# Altium project PCB_Project1.PrjPCB
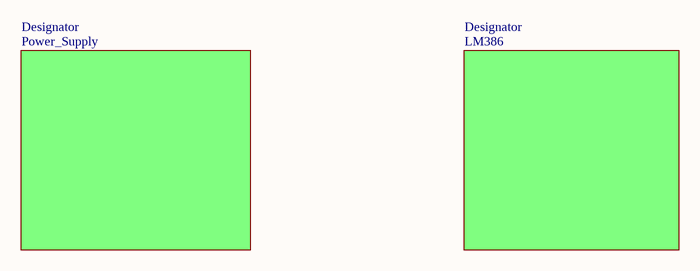
[diagram p0: Sheet1.SchDoc]
3 sheets, 39 parts. Net scope: global (net labels, ports and power ports of the same name join across sheets).
Board file: PCB1.PcbDoc
Sheets:
  Sheet1.SchDoc
    Designator = Power_Supply.SchDoc
    Designator = LM386.SchDoc

## Sheet Sheet1.SchDoc
size A4

### Sub-sheets
Designator = Power_Supply: no entries
Designator = LM386: no entries

## Sheet Power_Supply.SchDoc
size A4
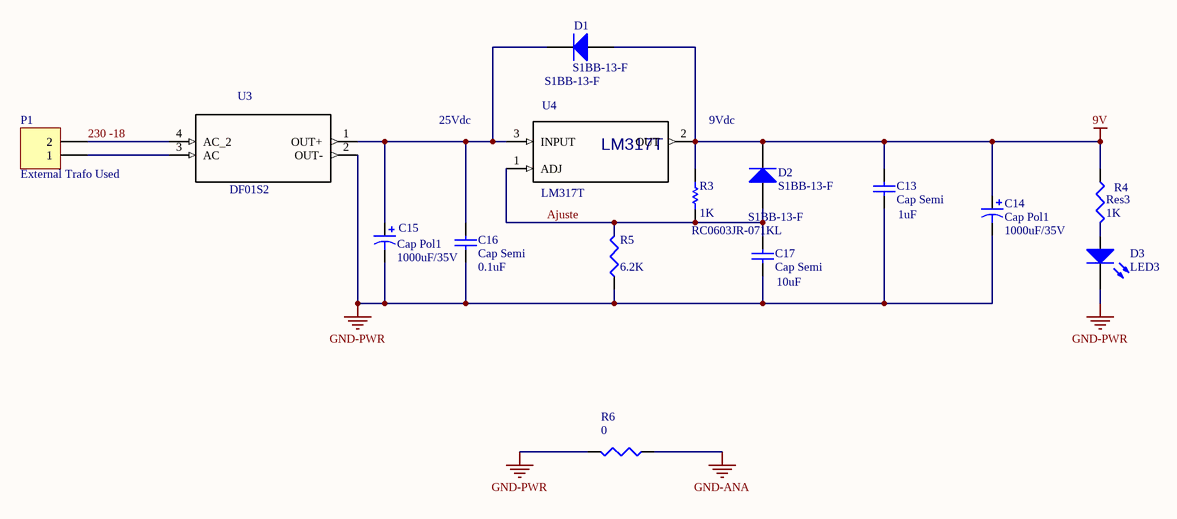
[diagram p1: Power_Supply.SchDoc]

### Parts
C13  Cap Semi  value 1uF  [1608[0603]]
C14  Cap Pol1  value 1000uF/35V  [RB7.6-15]
C15  Cap Pol1  value 1000uF/35V  [RB7.6-15]
C16  Cap Semi  value 0.1uF  [1608[0603]]
C17  Cap Semi  value 10uF  [1608[0603]]
D1  S1BB-13-F  [DIOM505270X240]
D2  S1BB-13-F  [DIOM505270X240]
D3  LED3  [6-0805_L]
P1  External Trafo Used  [PCBComponent_1]
R3  value 1K  PN: RC0603JR-071KL  [J1-0603]  (hidden comment: Res1)
R4  Res3  value 1K  [J1-0603]
R5  value 6.2K  [J1-0603]  (hidden comment: Res3)
R6  value 0  [6-0805_N]  (hidden comment: Res3)
U3  DF01S2  [SOT508P985X260-4N]
U4  LM317T  [TO254P460X1020X1945-3P]

### Nets
9V: C13.2 C14.1 D1.1(A) D2.2(K) R3.1 R4.1 U4.2(OUT)
GND-ANA: R6.1
GND-PWR: C13.1 C14.2 C15.2 C16.1 C17.1 D3.2(K) R5.1 R6.2 U3.2(OUT-)
230 -18: P1.2 U3.4(AC_2)
Ajuste: C17.2 D2.1(A) R3.2 R5.2 U4.1(ADJ)
NetC15_1: C15.1 C16.2 D1.2(K) U3.1(OUT+) U4.3(INPUT)
NetD3_1: D3.1(A) R4.2
NetP1_1: P1.1 U3.3(AC)

### Notes on the sheet
- 25Vdc
- 9Vdc

### Library data of the parts
C13 = Cap Semi: Capacitor (Semiconductor SIM Model) C1608JB1V105K080AB; PN: CL10A105KL8NNNC; Published: 8-Jun-2000; LatestRevisionDate: 29-May-2009; LatestRevisionNote: IPC-7351 Footprint Added.; PackageReference: C1206; Publisher: Altium Limited; PackageDescription: Chip Capacitor
C14 C15 = Cap Pol1: Polarized Capacitor (Radial) URS1V102MHD; Published: 8-Jun-2000; LatestRevisionDate: 17-Jul-2002; LatestRevisionNote: Re-released for DXP Platform.; PackageReference: RB7.6-15; Publisher: Altium Limited; PackageDescription: Polarized Capacitor (Radial); 2 Leads; PN: URS1V102MHD
C16 = Cap Semi: Capacitor (Semiconductor SIM Model) C0603T104J5RACTU; PN: CC0603JRX7R9BB104; Published: 8-Jun-2000; LatestRevisionDate: 29-May-2009; LatestRevisionNote: IPC-7351 Footprint Added.; PackageReference: C1206; Publisher: Altium Limited; PackageDescription: Chip Capacitor
C17 = Cap Semi: Capacitor (Semiconductor SIM Model) GRM188R6YA106MA73D; PN: C2012JB1V106K125AC; Published: 8-Jun-2000; LatestRevisionDate: 29-May-2009; LatestRevisionNote: IPC-7351 Footprint Added.; PackageReference: C1206; Publisher: Altium Limited; PackageDescription: Chip Capacitor
D1 D2 = Diode 1N4002: 100V 1 Amp General Purpose Rectifier; pin to pad: 1>A 2>C; Published: 8-Jun-2000; LatestRevisionDate: 17-Jul-2002; LatestRevisionNote: Re-released for DXP Platform.; DatasheetVersion: 1998; PackageVersion: Aug-1999; PackageReference: DO-41; Publisher: Altium Limited; PackageDescription: Diode, Axial; Body 5.2 x 2.7 mm (LxDia. max), Lead Dia. 0.86 mm (max); Code_JEDEC: DO-204-AL; ComponentLink1Description: Manufacturer Link; ComponentLink1URL: http://www.fairchildsemi.com/; ComponentLink2Description: Datasheet; ComponentLink2URL: http://www.fairchildsemi.com/ds/1N%2F1N4001.pdf; Supplier 1: Mouser; Supplier Part Number 1: 621-S1BB-F; PN: S1BB-13-F
D3 = LED3: Typical BLUE SiC LED IN-S85ATR; PN: SML-H12P8TT86C; Published: 8-Jun-2000; LatestRevisionDate: 17-Dec-2003; LatestRevisionNote: PCB Footprint replaced.; DatasheetVersion: 16-Apr-2002; PackageVersion: 16-Apr-2002; PackageReference: 3.5X2.8X1.9; Publisher: Altium Limited; PackageDescription: SM LED; 2 C-Bend Leads; Body 3.5 x 2.8 x 1.9 mm, inc leads (LxWxH typ)
P1 = MHDR1X2: Header, 2-Pin; LatestRevisionDate: 17-Jul-2002; LatestRevisionNote: Re-released for DXP Platform.; Publisher: Altium Limited
R3 = Res1: Resistor ERJ-PA3J102V; Published: 8-Jun-2000; LatestRevisionDate: 17-Jul-2002; LatestRevisionNote: Re-released for DXP Platform.; PackageReference: AXIAL-0.3; Publisher: Altium Limited; PackageDescription: Axial Device, Thru-Hole; 2 Leads; 0.3 in Pin Spacing
R4 = Res3: Resistor ERJ-PA3J102V; PN: RC0603JR-071KL; Published: 8-Jun-2000; LatestRevisionDate: 29-May-2009; LatestRevisionNote: IPC-7351 Footprint Added.; PackageReference: J1-0603; Publisher: Altium Limited; PackageDescription: Chip Resistor
R5 = Res3: Resistor ERJ-PA3J622V; Published: 8-Jun-2000; LatestRevisionDate: 29-May-2009; LatestRevisionNote: IPC-7351 Footprint Added.; PackageReference: J1-0603; Publisher: Altium Limited; PackageDescription: Chip Resistor; PN: ERJ-PA3J622V
R6 = Res3: Resistor; PN: CRCW08050000Z0EAC; Published: 8-Jun-2000; LatestRevisionDate: 29-May-2009; LatestRevisionNote: IPC-7351 Footprint Added.; PackageReference: J1-0603; Publisher: Altium Limited; PackageDescription: Chip Resistor
U3 = DF01S: DF01S Series 1.5 A 100 V 5 uA Surface Mount Bridge Rectifier -SDIP-4; MF: ON Semiconductor; SnapEDA_Link: https://www.snapeda.com/parts/DF01S/ON%20Semiconductor/view-part/?ref=snap; MP: DF01S2; Package: SMD-4 ON Semiconductor; Digi-Key_Purchase_URL: https://www.digikey.es/product-detail/en/diodes-incorporated/DF01S/DF01SDI-ND/149499?utm_source=snapeda&utm_medium=aggregator&utm_campaign=symbol; Digi-Key_Part_Number: DF01SDI-ND; Value: *
U4 = LM317T: MF: Texas Instruments; SnapEDA_Link: https://www.snapeda.com/parts/LM317T/Texas%20Instruments/view-part/?ref=snap; PN: LM317T; Package: TO-220-3 HTC Korea; Price: None; Availability: Unavailable; Value: *

## Sheet LM386.SchDoc
size A4
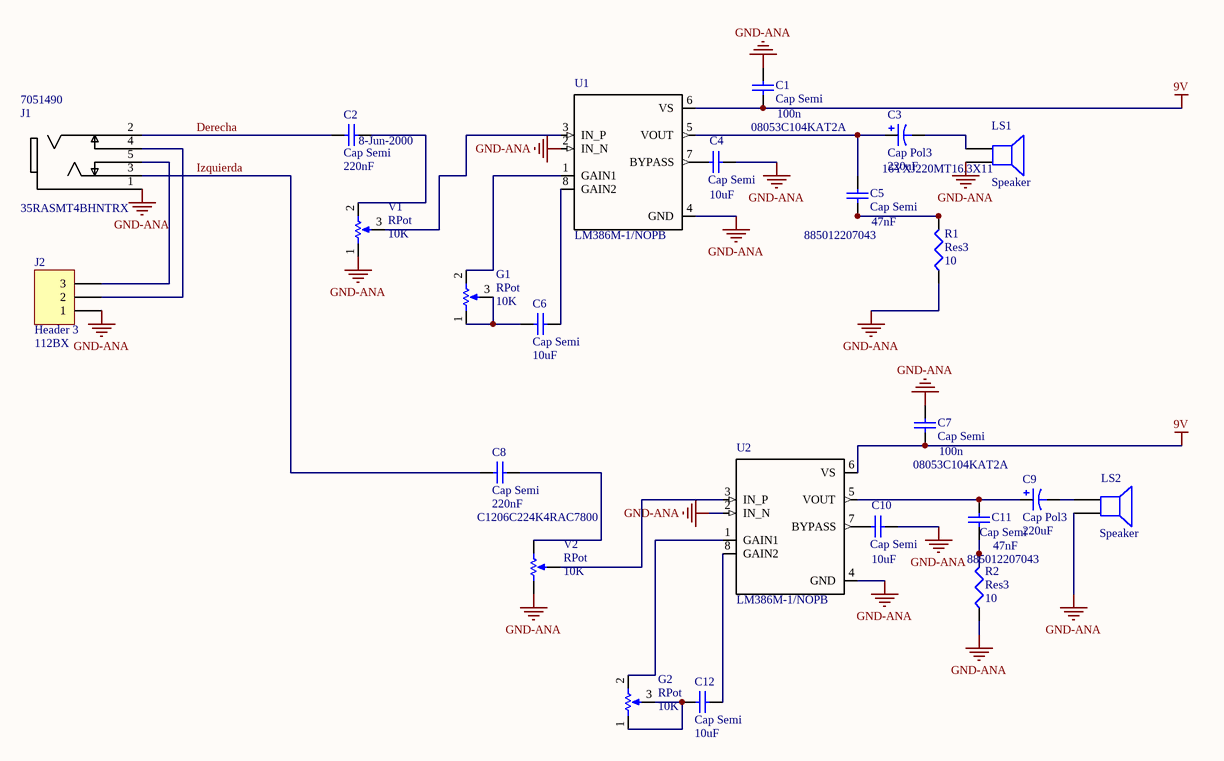
[diagram p2: LM386.SchDoc]

### Parts
C1  Cap Semi  value 100n  PN: 08053C104KAT2A  [C0805]
C2  Cap Semi  value 220nF  Published: 8-Jun-2000  [C1206]
C3  Cap Pol3  value 220uF  PN: 16YXJ220MT16.3X11  [C0805]
C4  Cap Semi  value 10uF  [C1206]
C5  Cap Semi  value 47nF  PN: 885012207043  [C0805]
C6  Cap Semi  value 10uF  [C0805]
C7  Cap Semi  value 100n  PN: 08053C104KAT2A  [C0805]
C8  Cap Semi  value 220nF  PN: C1206C224K4RAC7800  [C1206]
C9  Cap Pol3  value 220uF  [C0805]
C10  Cap Semi  value 10uF  [C0805]
C11  Cap Semi  value 47nF  PN: 885012207043  [C0805]
C12  Cap Semi  value 10uF  [C0805]
G1  RPot  value 10K  [Potenciometer]
G2  RPot  value 10K  [Potenciometer]
J1  35RASMT4BHNTRX  Supplier Part Number 1: 7051490  [SWITCHCRAFT_35RASMT4BHNTRX]
J2  Header 3  PN: 112BX  [HDR1X3]
LS1  Speaker  [PIN2]
LS2  Speaker  [PIN2]
R1  Res3  value 10  [SMD-0805-RES]
R2  Res3  value 10  [SMD-0805-RES]
U1  LM386M-1/NOPB  [SOIC127P600X175-8N]
U2  LM386M-1/NOPB  [SOIC127P600X175-8N]
V1  RPot  value 10K  [Potenciometer]
V2  RPot  value 10K  [Potenciometer]

### Nets
9V: C1.2 C7.2 U1.6(VS) U2.6(VS)
GND-ANA: C1.1 C4.1 C7.1 C10.1 J1.1 J2.1 LS1.2 LS2.2 R1.1 R2.1 U1.2(IN_N) U1.4(GND) U2.2(IN_N) U2.4(GND) V1.1(TOP) V2.1(TOP)
Derecha: C2.2 J1.2
Izquierda: C8.2 J1.3
NetC2_1: C2.1 V1.2(BOT)
NetC3_1: C3.1 C5.1 U1.5(VOUT)
NetC3_2: C3.2 LS1.1
NetC4_2: C4.2 U1.7(BYPASS)
NetC5_2: C5.2 R1.2
NetC6_1: C6.1 U1.8(GAIN2)
NetC6_2: C6.2 G1.1(TOP) G1.3(TAP)
NetC8_1: C8.1 V2.2(BOT)
NetC9_1: C9.1 C11.1 U2.5(VOUT)
NetC9_2: C9.2 LS2.1
NetC10_2: C10.2 U2.7(BYPASS)
NetC11_2: C11.2 R2.2
NetC12_1: C12.1 U2.8(GAIN2)
NetC12_2: C12.2 G2.1(TOP) G2.3(TAP)
NetG1_2: G1.2(BOT) U1.1(GAIN1)
NetG2_2: G2.2(BOT) U2.1(GAIN1)
NetJ1_4: J1.4 J2.2
NetJ1_5: J1.5 J2.3
NetU1_3: U1.3(IN_P) V1.3(TAP)
NetU2_3: U2.3(IN_P) V2.3(TAP)

### Library data of the parts
C1 C5 C7 C8 C11 = Cap Semi: Capacitor (Semiconductor SIM Model); Published: 8-Jun-2000; LatestRevisionDate: 29-May-2009; LatestRevisionNote: IPC-7351 Footprint Added.; PackageReference: C1206; Publisher: Altium Limited; PackageDescription: Chip Capacitor
C2 = Cap Semi: Capacitor (Semiconductor SIM Model); PN: C1206C224K4RAC7800; LatestRevisionDate: 29-May-2009; LatestRevisionNote: IPC-7351 Footprint Added.; PackageReference: C1206; Publisher: Altium Limited; PackageDescription: Chip Capacitor
C3 = Cap Pol3: Polarized Capacitor (Surface Mount); Published: 8-Jun-2000; LatestRevisionDate: 29-May-2009; LatestRevisionNote: IPC-7351 Footprint Added.; PackageReference: C0805; Publisher: Altium Limited; PackageDescription: Chip Capacitor; Supplier 1: Mouser; Supplier Part Number 1: 581-TAJC227K010RNJ
C4 = Cap Semi: Capacitor (Semiconductor SIM Model); PN: CL31B106MOHNNNE; Published: 8-Jun-2000; LatestRevisionDate: 29-May-2009; LatestRevisionNote: IPC-7351 Footprint Added.; PackageReference: C1206; Publisher: Altium Limited; PackageDescription: Chip Capacitor
C6 C10 C12 = Cap Semi: Capacitor (Semiconductor SIM Model); PN: CL21A106KOCLRNC; Published: 8-Jun-2000; LatestRevisionDate: 29-May-2009; LatestRevisionNote: IPC-7351 Footprint Added.; Publisher: Altium Limited; PackageDescription: Chip Capacitor
  C6 C12: PackageReference: C1206
  C10: PackageReference: C0805
C9 = Cap Pol3: Polarized Capacitor (Surface Mount); PN: 16YXJ220MT16.3X11; Published: 8-Jun-2000; LatestRevisionDate: 29-May-2009; LatestRevisionNote: IPC-7351 Footprint Added.; PackageReference: C0805; Publisher: Altium Limited; PackageDescription: Chip Capacitor
G1 G2 V2 = RPot: Potentiometer; pin to pad: 2>3 3>2; PN: P160KN-0QC20A10K; Set Position: 0.5; Published: 8-Jun-2000; LatestRevisionDate: 17-Jul-2002; LatestRevisionNote: Re-released for DXP Platform.; PackageReference: VR5; Publisher: Altium Limited; PackageDescription: Variable Resistor, Thru-Hole; 3 Leads
J1 = 35RASMT4BHNTRX: Conn 3.5MM Stereo Jack F 3 POS Solder RA SMD 5 Terminal 1 Port T/R; MF: Switchcraft; Package: None; PN: 35RASMT4BHNTRX; SnapEDA_Link: https://www.snapeda.com/parts/35RASMT4BHNTRX/Switchcraft%20Inc./view-part/?ref=snap; Availability: Unavailable; Price: None; Value: *; Supplier 1: RSComponents
J2 = Header 3: Header, 3-Pin; LatestRevisionDate: 17-Jul-2002; LatestRevisionNote: Re-released for DXP Platform.; Publisher: Altium Limited
LS1 LS2 = Speaker: Loudspeaker; Published: 24-Mar-1999; LatestRevisionDate: 17-Jul-2002; LatestRevisionNote: Re-released for DXP Platform.; PackageReference: PIN2; Publisher: Altium Limited
R1 R2 = Res3: Resistor; PN: RNCP0805FTD10R0; Published: 8-Jun-2000; LatestRevisionDate: 29-May-2009; LatestRevisionNote: IPC-7351 Footprint Added.; PackageReference: J1-0603; Publisher: Altium Limited; PackageDescription: Chip Resistor
U1 U2 = LM386M-1/NOPB: Wide Input Voltage Low Power Audio Amplifier with Internal Gain 8-SOIC 0 to 70; MF: Texas Instruments; Price: 0.76 USD; PN: LM386M-1/NOPB; Availability: Good; SnapEDA_Link: https://www.snapeda.com/parts/LM386M-1/Texas%20Instruments/view-part/?ref=snap; Package: SOIC-8 Texas Instruments; Supplier 1: RSComponents
V1 = RPot: Potentiometer; PN: P160KN-0QC20A10K; Set Position: 0.5; Published: 8-Jun-2000; LatestRevisionDate: 17-Jul-2002; LatestRevisionNote: Re-released for DXP Platform.; PackageReference: VR5; Publisher: Altium Limited; PackageDescription: Variable Resistor, Thru-Hole; 3 Leads

## Nets that join several sheets
9V: Power_Supply (7 pins), LM386 (C1.2 C7.2 U1.6 U2.6)
GND-ANA: Power_Supply (R6.1), LM386 (16 pins)